# Altium schematic sheet Sheet1-IR-Sensor.SchDoc: SysP18-Team-10
size A4; Author: Luzian Weber; CompanyName: NTB; Organization: NTB Interstate University of Applied; Address1: Werdenbergstrasse 4; Address3: 9471 Buchs; Address4: Switzerland; Organization1: Sciences of Technology Buchs; Size: A4
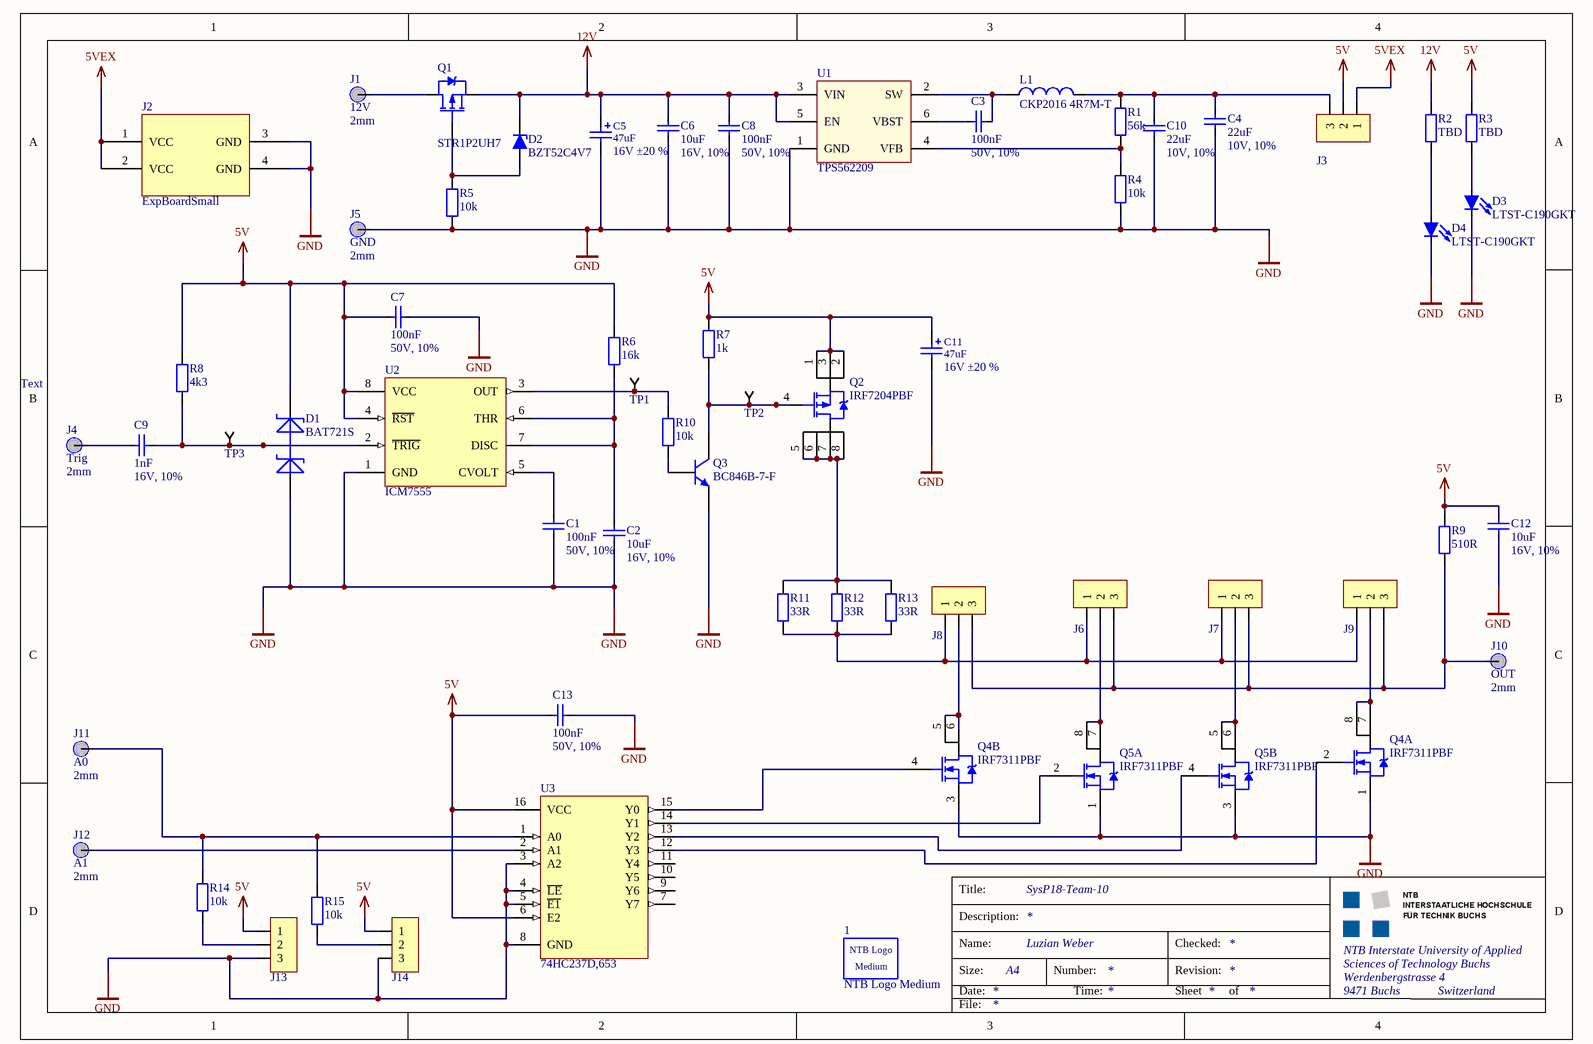
[diagram p0: Sheet1-IR-Sensor.SchDoc]

## Parts
1  NTB Logo Medium  [NTB Logo Medium Copper]
C1  100nF  ValAddon: 50V, 10%  [CAP-0805[2012]]
C2  10uF  ValAddon: 16V, 10%  [CAP-1206[3216]]
C3  100nF  ValAddon: 50V, 10%  [CAP-0805[2012]]
C4  22uF  ValAddon: 10V, 10%  [CAP-1206[3216]]
C5  value 47uF  ValueAddon: 16V ±20 %  [CDE_CAP AVE CODE D_H]  (hidden comment: AVE476M16D16T-F)
C6  10uF  ValAddon: 16V, 10%  [CAP-1206[3216]]
C7  100nF  ValAddon: 50V, 10%  [CAP-0805[2012]]
C8  100nF  ValAddon: 50V, 10%  [CAP-0805[2012]]
C9  1nF  ValueAddon: 16V, 10%  [CAP-0805[2012]]
C10  22uF  ValAddon: 10V, 10%  [CAP-1206[3216]]
C11  value 47uF  ValueAddon: 16V ±20 %  [CDE_CAP AVE CODE D_H]  (hidden comment: AVE476M16D16T-F)
C12  10uF  ValAddon: 16V, 10%  [CAP-1206[3216]]
C13  100nF  ValAddon: 50V, 10%  [CAP-0805[2012]]
D1  BAT721S  [SOT-23]
D2  BZT52C4V7  [SOD-123]
D3  LTST-C190GKT  [LED 0603 green]
D4  LTST-C190GKT  [LED 0603 green]
J1  12V  Size: 2mm  [Laborbuchse 2mm]
J2  ExpBoardSmall  [EXPBOARDCON]
J3  3 Pin Header  [3PIN HEADER 2.54MM]  (value not drawn)
J4  Trig  Size: 2mm  [Laborbuchse 2mm]
J5  GND  Size: 2mm  [Laborbuchse 2mm]
J6  3 Pin Header Buchse  [3PIN HEADER SOCKET 2.54MM]  (value not drawn)
J7  3 Pin Header Buchse  [3PIN HEADER SOCKET 2.54MM]  (value not drawn)
J8  3 Pin Header Buchse  [3PIN HEADER SOCKET 2.54MM]  (value not drawn)
J9  3 Pin Header Buchse  [3PIN HEADER SOCKET 2.54MM]  (value not drawn)
J10  OUT  Size: 2mm  [Laborbuchse 2mm]
J11  A0  Size: 2mm  [Laborbuchse 2mm]
J12  A1  Size: 2mm  [Laborbuchse 2mm]
J13  3 Pin Header  [3PIN HEADER 2.54MM]  (value not drawn)
J14  3 Pin Header  [3PIN HEADER 2.54MM]  (value not drawn)
L1  CKP2016 4R7M-T  [IND-0806]
Q1  STR1P2UH7  [SOT-23]
Q2  IRF7204PBF  [SOIC-8]
Q3  BC846B-7-F  [SOT-23]
Q4  IRF7311PBF  [SOIC-8]  (parts A,B of 2)
Q5  IRF7311PBF  [SOIC-8]  (parts A,B of 2)
R1  56k  [RES-0603[1608]]
R2  TBD  [RES-0603[1608]]
R3  TBD  [RES-0603[1608]]
R4  10k  [RES-0603[1608]]
R5  10k  [RES-0603[1608]]
R6  16k  [RES-0805[2012]]
R7  1k  [RES-0805[2012]]
R8  4k3  [RES-0805[2012]]
R9  510R  [RES-0805[2012]]
R10  10k  [RES-0805[2012]]
R11  33R  [RES-0805[2012]]
R12  33R  [RES-0805[2012]]
R13  33R  [RES-0805[2012]]
R14  10k  [RES-0805[2012]]
R15  10k  [RES-0805[2012]]
TP1  Testpoint SMD 1206  [TP-SMD-1206]  (value not drawn)  (no BOM)
TP2  Testpunkt THT 1mm  [TP-THT-1.1mm]  (value not drawn)
TP3  Testpunkt THT 1mm  [TP-THT-1.1mm]  (value not drawn)
U1  TPS562209  [SOT-23-6]
U2  ICM7555  [SOIC-8]
U3  74HC237D,653  [SOIC-16]

## Nets
5V: C7.1(Pos) C11.1(Pos) C12.1(Pos) C13.1(Pos) D1.2(cathode2) J3.2 J13.1 J14.1 Q2.1(S) Q2.2(S) Q2.3(S) R3.2 R6.2 R7.2 R8.2 R9.2 U2.4(~{RST}) U2.8(VCC) U3.6(E2) U3.16(VCC)
5VEX: J2.1(VCC) J2.2(VCC) J3.1
12V: C5.1(Pos) C6.1(Pos) C8.1(Pos) D2.1(K) Q1.2(S) R2.2 U1.3(VIN) U1.5(EN)
GND: C1.2(Neg) C2.2(Neg) C4.2(Neg) C5.2(Neg) C6.2(Neg) C7.2(Neg) C8.2(Neg) C10.2(Neg) C11.2(Neg) C12.2(Neg) C13.2(Neg) D1.1(Anode1) D3.1(K) D4.1(K) J2.3(GND) J2.4(GND) J5.1 J13.3 J14.3 Q3.2(E) Q4.1(S) Q4.3(S) Q5.1(S) Q5.3(S) R4.1 R5.1 U1.1(GND) U2.1(GND) U3.3(A2) U3.4(~{LE}) U3.5(~{E1}) U3.8(GND)
NetC1_1: C1.1(Pos) U2.5(CVOLT)
NetC2_1: C2.1(Pos) R6.1 U2.6(THR) U2.7(DISC)
NetC3_1: C3.1(Pos) U1.6(VBST)
NetC3_2: C3.2(Neg) L1.1 U1.2(SW)
NetC4_1: C4.1(Pos) C10.1(Pos) J3.3 L1.2 R1.2
NetC9_1: C9.1(Pos) J4.1
NetC9_2: C9.2(Neg) D1.3(Cathode1,_anode2) R8.1 TP3.1 U2.2(~{TRIG})
NetD2_2: D2.2(A) Q1.1(G) R5.2
NetD3_2: D3.2(A) R3.1
NetD4_2: D4.2(A) R2.1
NetJ1_1: J1.1 Q1.3(D)
NetJ6_1: J6.1 J7.1 J8.1 J9.1 R11.1 R12.1 R13.1
NetJ6_2: J6.2 Q5.7(D) Q5.8(D)
NetJ6_3: J6.3 J7.3 J8.3 J9.3 J10.1 R9.1
NetJ7_2: J7.2 Q5.5(D) Q5.6(D)
NetJ8_2: J8.2 Q4.5(D) Q4.6(D)
NetJ9_2: J9.2 Q4.7(D) Q4.8(D)
NetJ11_1: J11.1 R14.2 R15.2 U3.1(A0)
NetJ12_1: J12.1 U3.2(A1)
NetJ13_2: J13.2 R14.1
NetJ14_2: J14.2 R15.1
NetQ2_4: Q2.4(G) Q3.3(C) R7.1 TP2.1
NetQ2_5: Q2.5(D) Q2.6(D) Q2.7(D) Q2.8(D) R11.2 R12.2 R13.2
NetQ3_1: Q3.1(B) R10.1
NetQ4_2: Q4.2(G) U3.12(Y3)
NetQ4_4: Q4.4(G) U3.15(Y0)
NetQ5_2: Q5.2(G) U3.14(Y1)
NetQ5_4: Q5.4(G) U3.13(Y2)
NetR1_1: R1.1 R4.2 U1.4(VFB)
NetR10_2: R10.2 TP1.1 U2.3(OUT)

Not connected (* = marked no-connect by the designer): U3 7(Y7) 9(Y6) 10(Y5) 11(Y4)

## Notes on the sheet
- Text
- Title:
- Description:
- Size:
- Date:
- Name:
- Number:
- Time:
- Revision:
- Sheet
- Checked:
- of
- File:
- (in symbol NTB Logo Medium Copper) NTB Logo; Medium

## Library data of the parts
1 = NTB Logo Medium Copper
C1 C3 C7 C8 C13 = MLCC 0805 100n 50V: 100n 50V X7R MLCC 0805 (1608 Metric); Tolerance: 10%; Case-EIA: 0803; Case-Metric: 2013; Rated Voltage: 50V; Temperature Characteristics EIA: X7R; Temperature Range EIA: -55C/+125C; Value: 100nF
C2 C6 C12 = MLCC 1206 10u 16V: 10u 16V X7R MLCC 1206 (3016 Metric); Rated Voltage: 10V; Tolerance: 10%; Case-EIA: 1206; Case-Metric: 3216; Temperature Characteristics EIA: X7R; Temperature Range EIA: -55C/+125C; Value: 10uF
C4 C10 = MLCC 1206 22u 10V: 22u 10V X7R MLCC 1206 (3016 Metric); Tolerance: 10%; Case-EIA: 1206; Case-Metric: 3216; Rated Voltage: 10V; Temperature Characteristics EIA: X7R; Temperature Range EIA: -55C/+125C; Value: 22uF
C5 C11 = ELKO 47uF 16V: ELKO, 47uF, 16V, CDE_AVE476M16D16T-F_AVE CODE D; Manufacturer: Cornell Dubilier; #Class: PASSIVE; #ClassSub: CAPACITOR; RefFootprint: CDE_CAP AVE CODE D; Distributor PartNr: 598-AVE476M16D16T-F; Distributor: Mouser; Published: 20121220; Publisher: Stefan Ursella, M.Eng; ComponentLink1Description: Manufacturer Link; ComponentLink2Description: Datasheet; ComponentLink2URL: http://www.cde.com/catalogs/AVE.pdf; ComponentLink3Description: Packaging Specification; Manufacturer PartNr: AVE476M16D16T-F; RefFileFOO: *; RefFileSCH: *; RefSchema: CDE_AVE476M16D16T-F_AVE CODE D
C9 = MLCC 0805 1n 16V: MLCC - SMD/SMT 0805 1000pF 16V C0G 10%; Manufacturer: Vishay; Manufacturer PartNr: VJ0805A102KXJPW1BC; RefFootprint: Gen_0805_H; RefSchema: Cap_1nF; #Class: *; #SubClass: *; Published: 18.12.14; Publisher: SCLM; RefFileFOO: *; RefFileSCH: *; ComponentLink1Description: Manufacturer Link; ComponentLink1URL: http://www.vishay.com/product?docid=28548; ComponentLink2Description: Datasheet; ComponentLink2URL: http://www.vishay.com/docs/28548/vjw1bcbascomseries.pdf; Supplier 1: Mouser; Supplier Part Number 1: 77-VJ0805A102KXJPBC; Status: Lager?; Value: 1nF
D1 = BAT721S-SOT23: NXP  BAT721S  SCHOTTKY-DIODE, 2FACH; RefFootprint: CDE_CAP AVE CODE D; RefSchema: CDE_AVE476M16D16T-F_AVE CODE D; ComponentLink1Description: Manufacturer Link; ComponentLink1URL: http://www.nxp.com/search?q=%09bat721s&type=keyword&rows=10; ComponentLink2Description: Datasheet; ComponentLink2URL: http://www.farnell.com/datasheets/453891.pdf; ComponentLink3Description: Packaging Specification; Distributor: Farnell; Distributor PartNr: 1081200; Manufacturer: NXP; Manufacturer PartNr: BAT721S; Published: 20150612; Publisher: SCNP
D2 = BZT52C4V7: 4.7V Zener-Diode, BZT52C4V7; Forward Current: 1.5 A; Forward Voltage: 1.25V; Reverse Voltage: 600V; ComponentLink1Description: Datasheet RF2L6S; ComponentLink1URL: V:\Diodes\RHOM_RF2L6S.pdf
D3 D4 = LED Green: LED SMD 0603 green 6mcd; Forward Current: 30mA; Forward Voltage: 2.1V; Spectrum: 565nm; Color: green; ComponentLink1Description: Datasheet LTST-C190GKT; ComponentLink1URL: V:\Diodes\Lite-On-LTST-C190GKT.pdf
J1 J4 J5 J10-J12 = Laborbuchse: #Class: Connector; Publisher: B.Sc. Ursella; #ClassSub: Laborbuchse; Published: 2008-12-16; Status: nLager; RefFootprint: Laborbuchse 2mm; RefFileFOO: *; RefFileSCH: *; RefSchema: Laborbuchse
J2 = ExpBoardSmall: Rule: UNIONINDEX{}0[]RULEKIND{}ComponentClearance[]NETSCOPE{}AnyNet[]LAYERKIND{}SameLayer[]NAME{}Schematic Component Clearance Constraint[]GAP{}0mil[]COLLISIONCHECKMODE{}3[]VERTICALGAP{}0mil[]SHOWDISTANCES{}FALSE[]UNIT{}Imperial[]PcbType{}ProtelPcb
J3 J13 J14 = 3 Pin Header: 3 Pin Header 2.54mm; RefFootprint: GEN_Buchsenleiste-2.54MM_3; RefSchema: Gen_Buchsenleiste_3-Pin; #Class: *; #SubClass: *; Manufacturer: *; Manufacturer PartNr: *; Published: 16.12.2014; Publisher: SCLM; RefFileFOO: *; RefFileSCH: *; ComponentLink1Description: Manufacturer Link; ComponentLink1URL: *; ComponentLink2Description: Datasheet; ComponentLink2URL: *; Status: Lager?
J6-J9 = 3 Pin Header Buchse: 3 Pin Header 2.54mm Buchse; #Class: *; #SubClass: *; Manufacturer: *; Manufacturer PartNr: *; ComponentLink1Description: Manufacturer Link; ComponentLink1URL: *; ComponentLink2Description: *; ComponentLink2URL: *
L1 = L 4.7u: MULTILAYER CHIP POWER INDUCTORS; Manufactor: Taiyo Yuden; Current Rating: 900mA; DCR: 160mOhm; Inductance: 4u7; ComponentLink1Description: Datasheet Taiyo Yuden CK Series; ComponentLink1URL: V:\Inductor\Taiyo_Yuden_CK_Series.pdf
Q1 = STR1P2UH7: Low Power P-Kanal Mosfet; Manufacturer: ST Microelectronics; Rdson: 100mOhm; Vde: 30; ComponentLink1Description: Manufacturer Link; ComponentLink2Description: Datasheet
Q2 = IRF7204: High Power P-Kanal Mosfet; Manufacturer: International Rectifiers; RefFootprint: IRF_SO8_H; RefSchema: IRF_IRF7204_SO-8; Published: 8-Jun-2000; Publisher: Altium Limited; ComponentLink1Description: Manufacturer Link; ComponentLink1URL: http://www.irf.com/; ComponentLink2Description: Datasheet; ComponentLink2URL: http://www.irf.com/product-info/datasheets/data/irf7204.pdf; Manufacturer PartNr: IRF7204PBF; Supplier Part Number 1: 9103350; Supplier 1: Farnell; RefFileFOO: *; RefFileSCH: *; Status: nLager; #Class: *; #SubClass: *
Q3 = BC846B-SOT23: NPN General-purpose Transistor; Manufacturer: DIODES INC; #Class: SEMICONDUCTOR-TRANSISTOR; #ClassSub: BJT-NPN; RefFootprint: DIODS_SOT23_1B2E3C_3_H; RefSchema: DIODS_BC846B-7-F_SOT23; Published: 17-Sep-2003; Publisher: Altium Limited; ComponentLink1Description: Manufacturer Link; ComponentLink1URL: http://www.diodes.com/products/catalog/detail.php?item-id=6689&popup=datasheet; ComponentLink2Description: Datasheet; ComponentLink2URL: http://www.diodes.com/datasheets/ds11108.pdf; ComponentLink3Description: Packaging Specification; ComponentLink3URL: http://www.diodes.com/datasheets/ap02001.pdf; Distributor: Farnell; Manufacturer PartNr: BC846B-7-F; Distributor PartNr: 1773617; Status: nLager; RefFileFOO: *; RefFileSCH: *
Q4 Q5 = IRF7311: Dual N-Kanal Mosfet; Manufacturer: International Rectifier; RefFootprint: IRF_SO8_H; RefSchema: IRF_IRF7311_SO-8; Published: 8-Jun-2000; Publisher: Altium Limited; ComponentLink1Description: Manufacturer Link; ComponentLink1URL: http://www.irf.com/; ComponentLink2Description: Datasheet; ComponentLink2URL: http://www.irf.com/product-info/datasheets/data/irf7311.pdf; Supplier 1: Farnell; Manufacturer PartNr: IRF7311PBF; Supplier Part Number 1: 1013364; RefFileFOO: *; RefFileSCH: *; #Class: *; #SubClass: *; Status: nLager
R1-R5 = RES 0603: 0603 (1608 Metric) 1/10 W 10K 1 Thick Film Chip Resistor; Power: 1/10 W; Case-EIA: 0603; Case-Metric: 1608; Tolerance: 1%; Temp. Coefficent: ±100ppm; Technology: SMT; Value: 10K
R6 R8 = RES 0805: 0805 (2013 Metric) 1/10 W 10K 1 Thick Film Chip Resistor; Power: 1/10 W; Case-EIA: 0805; Case-Metric: 2013; Tolerance: 1%; Temp. Coefficent: ±100ppm; Technology: SMT
  R6: Value: 16k
  R8: Value: 4k3
R7 R9-R15 = RES 0805: 0805 (2013 Metric) 1/10 W 10K 1 Thick Film Chip Resistor; Power: 1/10 W; Case-EIA: 0805; Case-Metric: 2013; Tolerance: 1%; Temp. Coefficent: ±100ppm; Value: 16k; Technology: SMT
TP1 = Testpoint SMD 1206: Testpoint xSmall; Type: Standard (No BOM)
TP2 TP3 = Testpunkt THT 1mm: Manufacturer: Keystone Electronics; #Class: Connector; #ClassSub: Laborbuchse; RefFootprint: GEN_TP-THT-1.1mm_1_H; RefSchema: Testpunkt 1mm; Publisher: B.Sc. Ursella; Published: 2008-12-16; Supplier 1: Mouser; Supplier Part Number 1: 534-1035; Status: nLager; FootprintRef: GEN_TP-THT-1.1mm_1_H; RefFileFOO: *; RefFileSCH: *
U1 = TPS562209-SOT23-6: 3-A Synchronous Step-Down Voltage Regulator; Manufactor: Texas Instruments; Order Nr.: TPS562209DDCR; ComponentLink1Description: Datasheet TPS56x209; ComponentLink1URL: V:\Power_Management_ICs\PWM_Cont\TPS56x209.pdf
U2 = ICM7555-SOIC8: General purpose CMOS timer; Manufacturer: National Semiconductor; #Class: Analog; #SubClass: Timer Circuit; RefFootprint: NXP_SO8(SOT96-1)_H; RefSchema: NXP_ICM7555_SO-8; Published: 15/04/2002; Publisher: Altium Hobart Technology Centre; ComponentLink1Description: Datasheet; ComponentLink2Description: Distributor; ComponentLink1URL: http://www.datasheetcatalog.org/datasheet/intersil/fn2867.pdf; ComponentLink2URL: https://www.distrelec.ch/ishopWebFront/catalog/product.do/para/node/is/acaaabaaacaf/and/highlightNode/is/640145/and/id/is/01/and/series/is/1.html; Supplier 1: Mouser Electronics; Manufacturer PartNr: ICM7555; Supplier Part Number 1: 771-ICM7555; RefFileFOO: *; RefFileSCH: *; Status: nLager
U3 = 74HC237D-SOIC16: 3-to-8 line decoder, demultiplexer, NXP, SO16; RefFootprint: NXP_SO16(SOT109-1)_H; RefSchema: NXP_74HC237D_SO-16; Supplier 1: Mouser Electronics; Supplier Part Number 1: 771-HC237D653; Manufacturer PartNr: 74HC237D,653; Status: nLager; #Class: *; #SubClass: *; Manufacturer: NXP; Published: 28.11.2014; Publisher: SCLM; RefFileFOO: *; RefFileSCH: *; ComponentLink1Description: Manufacturer Link; ComponentLink1URL: http://www.nxp.com/products/logic/decoders_demultiplexers/74HC237D.html; ComponentLink2Description: Datasheet; ComponentLink2URL: http://www.nxp.com/documents/data_sheet/74HC237.pdf